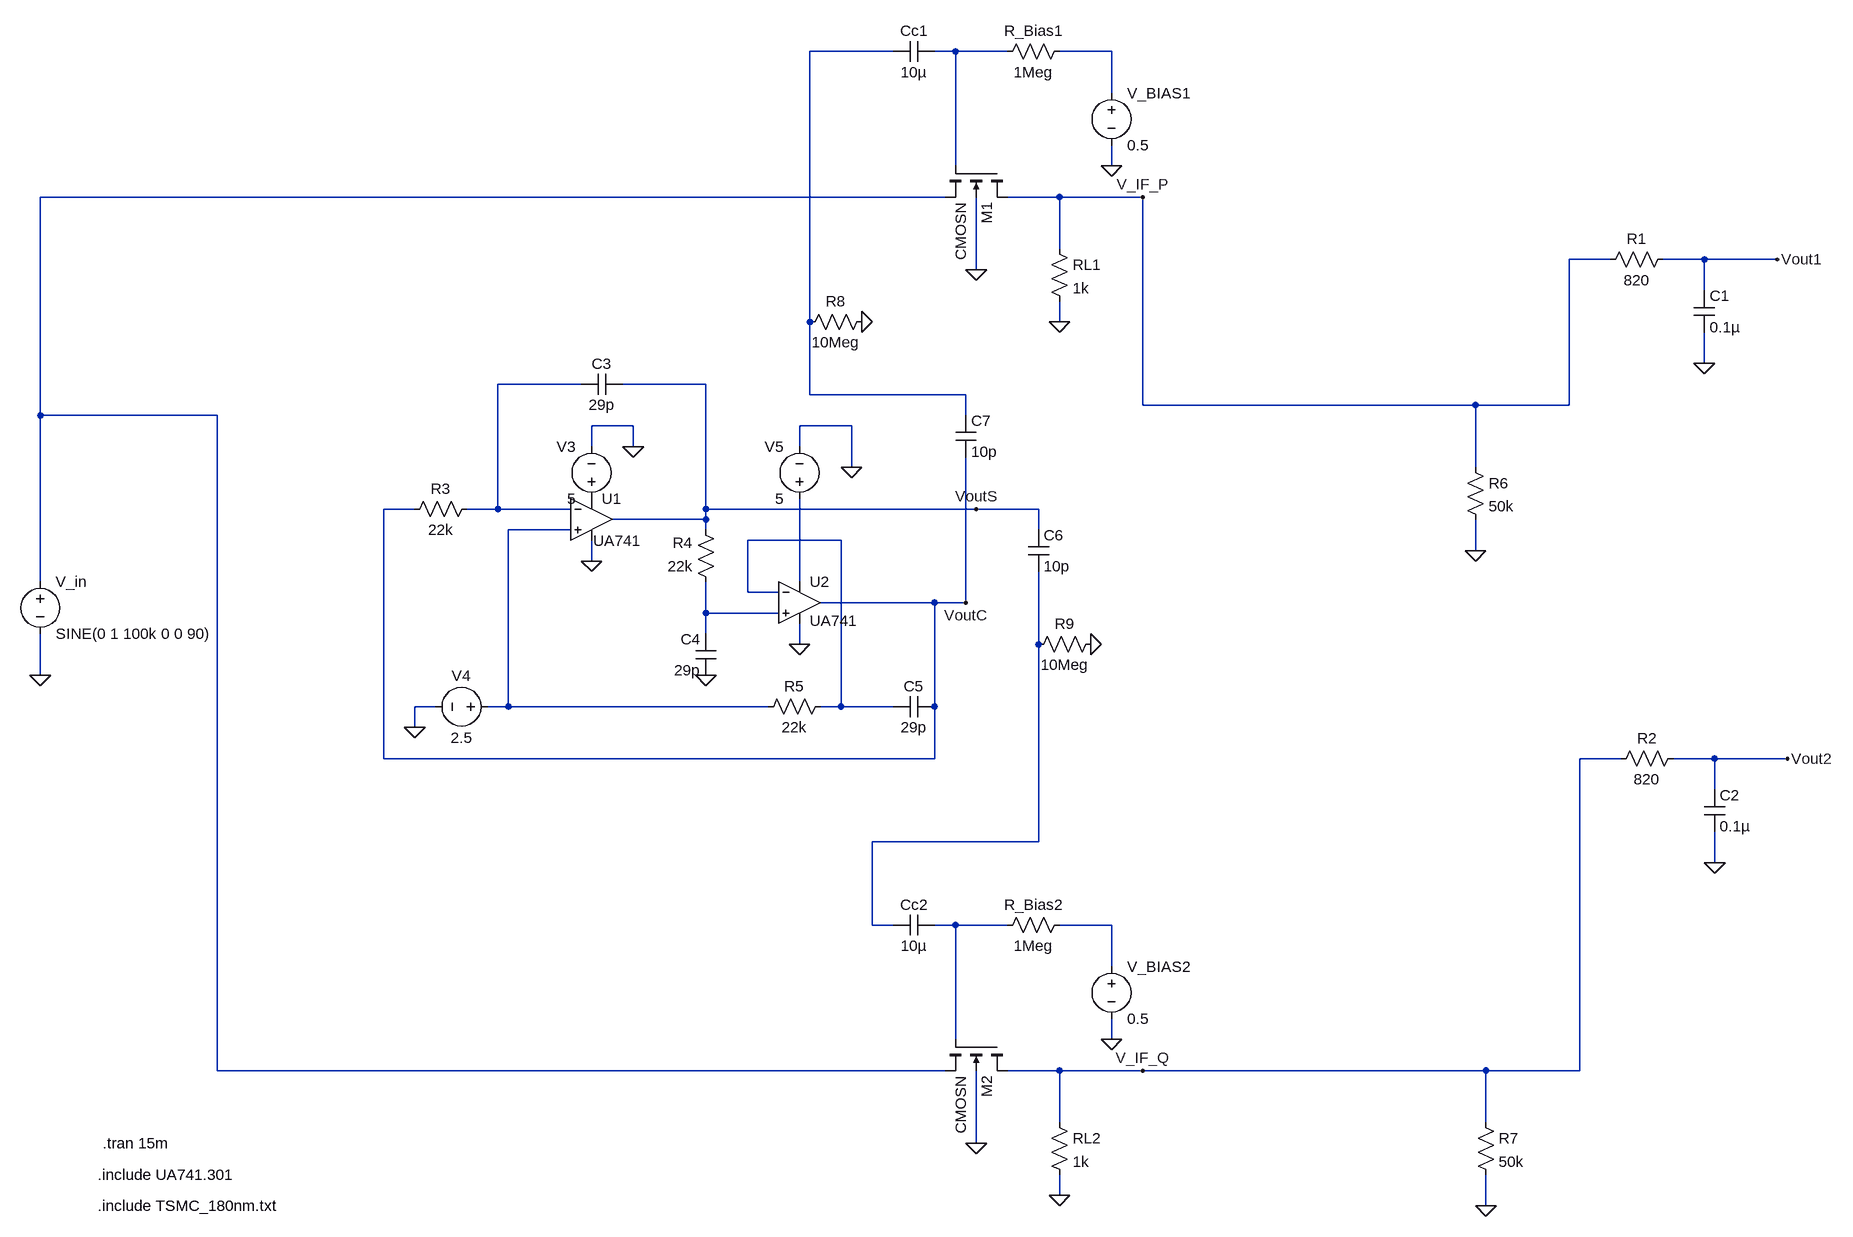
[diagram p0: schematic Combined.asc]
Combined.asc, the LTspice schematic file:
Version 4
SHEET 1 1244 1512
WIRE -912 -336 -1040 -336
WIRE -816 -336 -848 -336
WIRE -736 -336 -816 -336
WIRE -576 -336 -656 -336
WIRE -576 -272 -576 -336
WIRE -816 -160 -816 -336
WIRE -576 -160 -576 -192
WIRE -832 -112 -2224 -112
WIRE -656 -112 -736 -112
WIRE -528 -112 -656 -112
WIRE -656 -32 -656 -112
WIRE 192 -16 128 -16
WIRE 336 -16 272 -16
WIRE 448 -16 336 -16
WIRE -784 0 -784 -112
WIRE 336 32 336 -16
WIRE -1040 80 -1040 -336
WIRE -656 80 -656 48
WIRE 336 144 336 96
WIRE -1392 176 -1520 176
WIRE -1200 176 -1328 176
WIRE -1040 192 -1040 80
WIRE -800 192 -1040 192
WIRE -528 208 -528 -112
WIRE -16 208 -528 208
WIRE 128 208 128 -16
WIRE 128 208 -16 208
WIRE -2224 224 -2224 -112
WIRE -1952 224 -2224 224
WIRE -800 224 -800 192
WIRE -1312 240 -1376 240
WIRE -976 240 -1056 240
WIRE -1376 272 -1376 240
WIRE -1312 272 -1312 240
WIRE -1056 272 -1056 240
WIRE -976 304 -976 240
WIRE -16 304 -16 208
WIRE -1648 368 -1696 368
WIRE -1520 368 -1520 176
WIRE -1520 368 -1568 368
WIRE -1408 368 -1520 368
WIRE -1200 368 -1200 176
WIRE -784 368 -1200 368
WIRE -688 368 -784 368
WIRE -1200 384 -1200 368
WIRE -1200 384 -1344 384
WIRE -1408 400 -1504 400
WIRE -1200 400 -1200 384
WIRE -688 400 -688 368
WIRE -992 416 -1136 416
WIRE -16 432 -16 384
WIRE -1376 448 -1376 416
WIRE -2224 480 -2224 224
WIRE -1056 480 -1056 352
WIRE -1136 496 -1136 416
WIRE -1088 496 -1136 496
WIRE -848 512 -1024 512
WIRE -800 512 -800 288
WIRE -800 512 -848 512
WIRE -1200 528 -1200 480
WIRE -1088 528 -1200 528
WIRE -1200 560 -1200 528
WIRE -1056 576 -1056 544
WIRE -688 576 -688 464
WIRE -2224 624 -2224 560
WIRE -1616 672 -1648 672
WIRE -1504 672 -1504 400
WIRE -1504 672 -1536 672
WIRE -1104 672 -1504 672
WIRE -992 672 -992 416
WIRE -992 672 -1024 672
WIRE -912 672 -992 672
WIRE -848 672 -848 512
WIRE -1648 704 -1648 672
WIRE -1696 752 -1696 368
WIRE -848 752 -848 672
WIRE -848 752 -1696 752
WIRE 208 752 144 752
WIRE 352 752 288 752
WIRE 464 752 352 752
WIRE 352 800 352 752
WIRE -688 880 -688 576
WIRE -688 880 -944 880
WIRE 352 912 352 864
WIRE -944 1008 -944 880
WIRE -912 1008 -944 1008
WIRE -816 1008 -848 1008
WIRE -736 1008 -816 1008
WIRE -576 1008 -656 1008
WIRE -576 1072 -576 1008
WIRE -816 1184 -816 1008
WIRE -576 1184 -576 1152
WIRE -1952 1232 -1952 224
WIRE -832 1232 -1952 1232
WIRE -656 1232 -736 1232
WIRE -528 1232 -656 1232
WIRE 0 1232 -528 1232
WIRE 144 1232 144 752
WIRE 144 1232 0 1232
WIRE -656 1312 -656 1232
WIRE 0 1312 0 1232
WIRE -784 1344 -784 1232
WIRE -656 1424 -656 1392
WIRE 0 1440 0 1392
FLAG 336 144 0
FLAG 448 -16 Vout1
FLAG 352 912 0
FLAG 464 752 Vout2
FLAG -1376 448 0
FLAG -1200 624 0
FLAG -1312 272 0
FLAG -1648 704 0
FLAG -800 512 VoutC
FLAG -784 368 VoutS
FLAG -1056 576 0
FLAG -976 304 0
FLAG -576 -160 0
FLAG -784 0 0
FLAG -656 80 0
FLAG -528 -112 V_IF_P
FLAG -576 1184 0
FLAG -784 1344 0
FLAG -656 1424 0
FLAG -528 1232 V_IF_Q
FLAG -2224 624 0
FLAG -16 432 0
FLAG 0 1440 0
FLAG -960 80 0
FLAG -608 576 0
SYMBOL cap 320 32 R0
SYMATTR InstName C1
SYMATTR Value 0.1µ
SYMBOL res 288 -32 R90
WINDOW 0 0 56 VBottom 2
WINDOW 3 32 56 VTop 2
SYMATTR InstName R1
SYMATTR Value 820
SYMBOL cap 336 800 R0
SYMATTR InstName C2
SYMATTR Value 0.1µ
SYMBOL res 304 736 R90
WINDOW 0 0 56 VBottom 2
WINDOW 3 32 56 VTop 2
SYMATTR InstName R2
SYMATTR Value 820
SYMBOL OpAmps\\opamp2 -1376 320 R0
WINDOW 3 3 97 Left 2
SYMATTR Value UA741
SYMATTR InstName U1
SYMBOL res -1552 352 R90
WINDOW 0 0 56 VBottom 2
WINDOW 3 32 56 VTop 2
SYMATTR InstName R3
SYMATTR Value 22k
SYMBOL res -1184 496 R180
WINDOW 0 36 76 Left 2
WINDOW 3 36 40 Left 2
SYMATTR InstName R4
SYMATTR Value 22k
SYMBOL cap -1328 160 R90
WINDOW 0 0 32 VBottom 2
WINDOW 3 32 32 VTop 2
SYMATTR InstName C3
SYMATTR Value 29p
SYMBOL cap -1184 624 R180
WINDOW 0 24 56 Left 2
WINDOW 3 24 8 Left 2
SYMATTR InstName C4
SYMATTR Value 29p
SYMBOL res -1008 656 R90
WINDOW 0 0 56 VBottom 2
WINDOW 3 32 56 VTop 2
SYMATTR InstName R5
SYMATTR Value 22k
SYMBOL cap -848 656 R90
WINDOW 0 0 32 VBottom 2
WINDOW 3 32 32 VTop 2
SYMATTR InstName C5
SYMATTR Value 29p
SYMBOL voltage -1376 368 R180
WINDOW 0 24 96 Left 2
WINDOW 3 24 16 Left 2
WINDOW 123 0 0 Left 0
WINDOW 39 0 0 Left 0
SYMATTR InstName V3
SYMATTR Value 5
SYMBOL voltage -1520 672 R90
WINDOW 0 -32 56 VBottom 2
WINDOW 3 32 56 VTop 2
WINDOW 123 0 0 Left 0
WINDOW 39 0 0 Left 0
SYMATTR InstName V4
SYMATTR Value 2.5
SYMBOL OpAmps\\opamp2 -1056 448 R0
WINDOW 3 16 92 Left 2
SYMATTR Value UA741
SYMATTR InstName U2
SYMBOL voltage -1056 368 R180
WINDOW 0 24 96 Left 2
WINDOW 3 24 16 Left 2
WINDOW 123 0 0 Left 0
WINDOW 39 0 0 Left 0
SYMATTR InstName V5
SYMATTR Value 5
SYMBOL nmos4 -736 -160 R90
SYMATTR InstName M1
SYMATTR Value CMOSN
SYMATTR Value2 l=0.18u w=1.8u ad=0.81p as=0.81p pd=4.5u ps=4.5u
SYMBOL voltage -576 -288 R0
WINDOW 123 0 0 Left 0
WINDOW 39 0 0 Left 0
SYMATTR InstName V_BIAS1
SYMATTR Value 0.5
SYMBOL res -640 -352 R90
WINDOW 0 0 56 VBottom 2
WINDOW 3 32 56 VTop 2
SYMATTR InstName R_Bias1
SYMATTR Value 1Meg
SYMBOL res -672 -48 R0
SYMATTR InstName RL1
SYMATTR Value 1k
SYMBOL cap -848 -352 R90
WINDOW 0 0 32 VBottom 2
WINDOW 3 32 32 VTop 2
SYMATTR InstName Cc1
SYMATTR Value 10µ
SYMBOL nmos4 -736 1184 R90
SYMATTR InstName M2
SYMATTR Value CMOSN
SYMATTR Value2 l=0.18u w=1.8u ad=0.81p as=0.81p pd=4.5u ps=4.5u
SYMBOL voltage -576 1056 R0
WINDOW 123 0 0 Left 0
WINDOW 39 0 0 Left 0
SYMATTR InstName V_BIAS2
SYMATTR Value 0.5
SYMBOL res -640 992 R90
WINDOW 0 0 56 VBottom 2
WINDOW 3 32 56 VTop 2
SYMATTR InstName R_Bias2
SYMATTR Value 1Meg
SYMBOL res -672 1296 R0
SYMATTR InstName RL2
SYMATTR Value 1k
SYMBOL cap -848 992 R90
WINDOW 0 0 32 VBottom 2
WINDOW 3 32 32 VTop 2
SYMATTR InstName Cc2
SYMATTR Value 10µ
SYMBOL voltage -2224 464 R0
WINDOW 123 0 0 Left 0
WINDOW 39 0 0 Left 0
SYMATTR InstName V_in
SYMATTR Value SINE(0 1 100k 0 0 90)
SYMBOL res -32 288 R0
SYMATTR InstName R6
SYMATTR Value 50k
SYMBOL res -16 1296 R0
SYMATTR InstName R7
SYMATTR Value 50k
SYMBOL cap -704 400 R0
SYMATTR InstName C6
SYMATTR Value 10p
SYMBOL cap -816 224 R0
SYMATTR InstName C7
SYMATTR Value 10p
SYMBOL res -944 64 R90
WINDOW 0 0 56 VBottom 2
WINDOW 3 32 56 VTop 2
SYMATTR InstName R8
SYMATTR Value 10Meg
SYMBOL res -592 560 R90
WINDOW 0 0 56 VBottom 2
WINDOW 3 32 56 VTop 2
SYMATTR InstName R9
SYMATTR Value 10Meg
TEXT -2136 1392 Left 2 !.include UA741.301
TEXT -2136 1440 Left 2 !.include TSMC_180nm.txt
TEXT -2128 1344 Left 2 !.tran 15m

The netlist it stands for:
* Combined.asc
C1 Vout1 0 0.1µ
R1 Vout1 V_IF_P 820
C2 Vout2 0 0.1µ
R2 Vout2 V_IF_Q 820
XU1 N006 N005 P001 0 VoutS UA741  ; pins In+ In- V+ V- OUT
R3 N005 VoutC 22k
R4 N009 VoutS 22k
C3 VoutS N005 29p
C4 0 N009 29p
R5 N007 N006 22k
C5 VoutC N007 29p
V3 P001 0 5
V4 N006 0 2.5
XU2 N009 N007 N008 0 VoutC UA741  ; pins In+ In- V+ V- OUT
V5 N008 0 5
M1 V_IF_P N002 N004 0 CMOSN l=0.18u w=1.8u ad=0.81p as=0.81p pd=4.5u ps=4.5u
V_BIAS1 N003 0 0.5
R_Bias1 N003 N002 1Meg
RL1 V_IF_P 0 1k
Cc1 N002 N001 10µ
M2 V_IF_Q N011 N004 0 CMOSN l=0.18u w=1.8u ad=0.81p as=0.81p pd=4.5u ps=4.5u
V_BIAS2 N012 0 0.5
R_Bias2 N012 N011 1Meg
RL2 V_IF_Q 0 1k
Cc2 N011 N010 10µ
V_in N004 0 SINE(0 1 100k 0 0 90)
R6 V_IF_P 0 50k
R7 V_IF_Q 0 50k
C6 VoutS N010 10p
C7 N001 VoutC 10p
R8 0 N001 10Meg
R9 0 N010 10Meg
.model NMOS NMOS
.model PMOS PMOS
.lib standard.mos
.include UA741.301
.include TSMC_180nm.txt
.tran 15m
.backanno
.end